# Altium project VISION_BETA_EBB.PrjPcb (part 9 of 9)

## Sheet DAC.SchDoc
size B; SheetNumber: 14; SheetTotal: 19
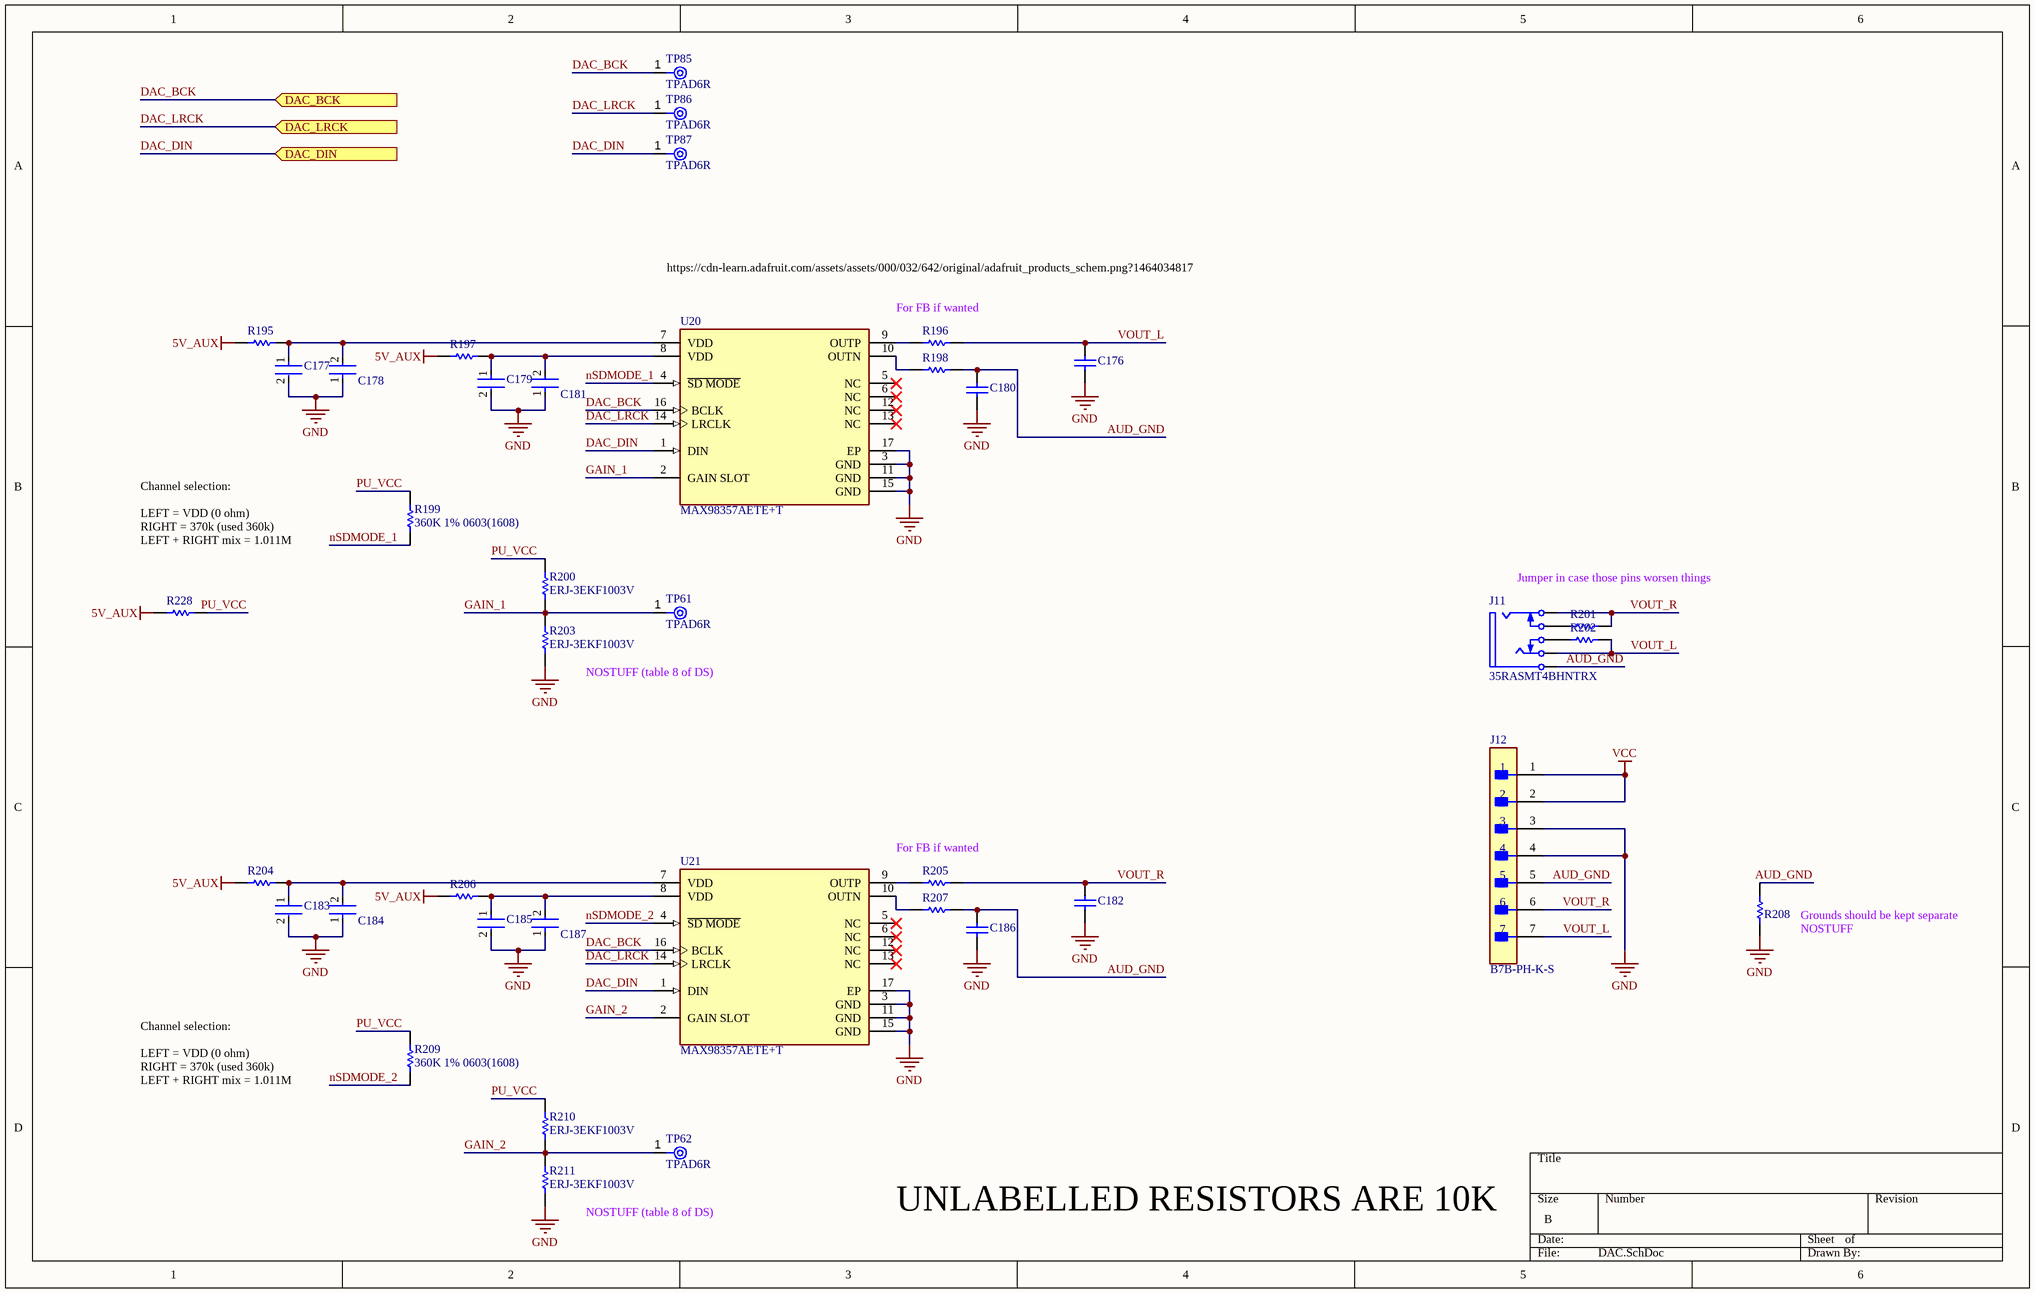
[diagram p45: DAC.SchDoc]

### Parts
C176  C0805C221K5RACTU  [CAPC2013X88X50ML20T25]  (value not drawn)
C177  CL05A106MP5NUNC  [FP-CL05A106MP5NUNC-MFG]  (value not drawn)
C178  C1005X7R1H104K050BB  [FP-C1005-050-0_05-IPC_C]  (value not drawn)
C179  CL05A106MP5NUNC  [FP-CL05A106MP5NUNC-MFG]  (value not drawn)
C180  C0805C221K5RACTU  [CAPC2013X88X50ML20T25]  (value not drawn)
C181  C1005X7R1H104K050BB  [FP-C1005-050-0_05-IPC_C]  (value not drawn)
C182  C0805C221K5RACTU  [CAPC2013X88X50ML20T25]  (value not drawn)
C183  CL05A106MP5NUNC  [FP-CL05A106MP5NUNC-MFG]  (value not drawn)
C184  C1005X7R1H104K050BB  [FP-C1005-050-0_05-IPC_C]  (value not drawn)
C185  CL05A106MP5NUNC  [FP-CL05A106MP5NUNC-MFG]  (value not drawn)
C186  C0805C221K5RACTU  [CAPC2013X88X50ML20T25]  (value not drawn)
C187  C1005X7R1H104K050BB  [FP-C1005-050-0_05-IPC_C]  (value not drawn)
J11  35RASMT4BHNTRX  [SWIT-35RASMT4BHNTRX_V]
J12  B7B-PH-K-S  [FP-B7B-PH-K-S-MFG]
R195  RC0402JR-070RL  [RESC1005X40X25NL05T10]  (value not drawn)
R196  RC0603JR-070RL  [RESC1608X55X25ML10T15]  (value not drawn)
R197  RC0402JR-070RL  [RESC1005X40X25NL05T10]  (value not drawn)
R198  RC0603JR-070RL  [RESC1608X55X25ML10T15]  (value not drawn)
R199  360K 1% 0603(1608)  [RESC0603(1608)_M]
R200  ERJ-3EKF1003V  [RESC1608X55X30ML15T15]
R201  RC0402JR-070RL  [RESC1005X40X25NL05T10]  (value not drawn)
R202  RC0402JR-070RL  [RESC1005X40X25NL05T10]  (value not drawn)
R203  ERJ-3EKF1003V  [RESC1608X55X30ML15T15]
R204  RC0402JR-070RL  [RESC1005X40X25NL05T10]  (value not drawn)
R205  RC0603JR-070RL  [RESC1608X55X25ML10T15]  (value not drawn)
R206  RC0402JR-070RL  [RESC1005X40X25NL05T10]  (value not drawn)
R207  RC0603JR-070RL  [RESC1608X55X25ML10T15]  (value not drawn)
R208  RC0603JR-070RL  [RESC1608X55X25ML10T15]  (value not drawn)
R209  360K 1% 0603(1608)  [RESC0603(1608)_M]
R210  ERJ-3EKF1003V  [RESC1608X55X30ML15T15]
R211  ERJ-3EKF1003V  [RESC1608X55X30ML15T15]
R228  RC0402JR-070RL  [RESC1005X40X25NL05T10]  (value not drawn)
TP61  TPAD6R  [New footprint 1]
TP62  TPAD6R  [New footprint 1]
TP85  TPAD6R  [New footprint 1]
TP86  TPAD6R  [New footprint 1]
TP87  TPAD6R  [New footprint 1]
U20  MAX98357AETE+T  [FP-T1633-4-MFG]
U21  MAX98357AETE+T  [FP-T1633-4-MFG]

### Ports
DAC_BCK (in, see VISION_BETA_EBB[4C]), DAC_DIN (in, see VISION_BETA_EBB[4C]), DAC_LRCK (in, see VISION_BETA_EBB[4C])

### Nets
5V_AUX: R195.1 R197.1 R204.1 R206.1 R228.1  [project net 5V_REG_FB]
GND: C176.1 C177.2 C178.1 C179.2 C180.1 C181.1 C182.1 C183.2 C184.1 C185.2 C186.1 C187.1 J12.3 J12.4 R203.1 R208.2 R211.1 U20.3(GND) U20.11(GND) U20.15(GND) U20.17(EP) U21.3(GND) U21.11(GND) U21.15(GND) U21.17(EP)
VCC: J12.1 J12.2
AUD_GND: C180.2 C186.2 J11.1 J12.5 R198.2 R207.2 R208.1
DAC_BCK: TP85.1(TP) U20.16(BCLK) U21.16(BCLK) ; port DAC_BCK
DAC_DIN: TP87.1(TP) U20.1(DIN) U21.1(DIN) ; port DAC_DIN
DAC_LRCK: TP86.1(TP) U20.14(LRCLK) U21.14(LRCLK) ; port DAC_LRCK
GAIN_1: R200.1 R203.2 TP61.1(TP) U20.2(GAIN_SLOT)
GAIN_2: R210.1 R211.2 TP62.1(TP) U21.2(GAIN_SLOT)
nSDMODE_1: R199.1 U20.4(~{SD_MODE})
nSDMODE_2: R209.1 U21.4(~{SD_MODE})
PU_VCC: R199.2 R200.2 R209.2 R210.2 R228.2
VOUT_L: C176.2 J11.3 J12.7 R196.2 R202.2
VOUT_R: C182.2 J11.2 J12.6 R201.2 R205.2
NetC177_1: C177.1 C178.2 R195.2 U20.7(VDD)
NetC179_1: C179.1 C181.2 R197.2 U20.8(VDD)
NetC183_1: C183.1 C184.2 R204.2 U21.7(VDD)
NetC185_1: C185.1 C187.2 R206.2 U21.8(VDD)
NetJ11_4: J11.4 R201.1
NetJ11_5: J11.5 R202.1
NetR196_1: R196.1 U20.9(OUTP)
NetR198_1: R198.1 U20.10(OUTN)
NetR205_1: R205.1 U21.9(OUTP)
NetR207_1: R207.1 U21.10(OUTN)

Not connected (* = marked no-connect by the designer): U20 5(NC)* 6(NC)* 12(NC)* 13(NC)*; U21 5(NC)* 6(NC)* 12(NC)* 13(NC)*

### Notes on the sheet
- https://cdn-learn.adafruit.com/assets/assets/000/032/642/original/adafruit_products_schem.png?1464034817
- For FB if wanted
- Channel selection:
  LEFT = VDD (0 ohm)
  RIGHT = 370k (used 360k)
  LEFT + RIGHT mix = 1.011M
- Jumper in case those pins worsen things
- NOSTUFF (table 8 of DS)
- (near R208) Grounds should be kept separate
- (near R208) NOSTUFF
- UNLABELLED RESISTORS ARE 10K

### Library data of the parts
C176 C180 C182 C186 = CMP-2007-00321-1: Manufacturer: Kemet; Part Number: C0805C221K5RACTU
C177 C179 C183 C185 = CMP-13271-000002-1: CAP CER 10UF 10V X5R 0402; Manufacturer: Samsung; Temperature Coefficient: 15%; Tolerance: 20%; Material: Ceramic; Octopart: https://octopart.com/cl05a106mp5nunc-samsung-22457395; Voltage Rating: 10V; RoHS: TRUE; Value: 10uF; Height: 0.7mm; Digikey Description: CAP CER 10UF 10V X5R 0402; Automotive: No; Package: CL05A106MP5NUNC; Device Class L1: Passive Components; Capacitance: 10uF; Temperature Range High: +85°C; ComponentLink2Description: Datasheet; Device Class L2: Capacitors; Temperature Characteristic: X5R; Manufacturer Part Number: CL05A106MP5NUNC; Temperature: -55°C to +85°C; ComponentLink2URL: http://www.samsungsem.com/kr/support/product-search/mlcc/__icsFiles/afieldfile/2019/05/10/19-CL05A106MP5NUNC.pdf; Device Class L3: Ceramic Capacitors; Category: Cap; Temperature Range Low: -55°C; Ipc Land Pattern Name: CAPC10050X50; Lead Free: Yes
C178 C181 C184 C187 = CMP-2000-05393-2: Multilayer Ceramic Capacitors 100nF ±10% 50V X7R SMD 0402; Voltage: 50V; Dielectric Material: Ceramic; Min Operating Temperature: -55°C; Depth: 0.5mm; Radiation Hardening: No; RoHS Compliant: Yes; Voltage Rating (DC): 50V; Lead Free: Lead Free; Resistor Type: Ceramic; Height: 0.5mm; Dielectric: X7R; Thickness: 0.022inch; Case/Package: 0402; Case Code (Metric): 1005; Termination: SMD/SMT; Capacitance: 100nF; Packaging: Tape and Reel; Max Operating Temperature: 125°C; Mount: Surface Mount; Package Quantity: 1; Width: 0.02inch; Weight: 2.3E-05oz; Voltage Rating: 50V; Tolerance: 10%; Construction: Flat; Case Code (Imperial): 0402; Length: 1mm; REACH SVHC: No SVHC; Series: C
J11 = CMP-1772-00001-1: Female 3.5 mm Phone Jack, 5 Position, Height 5 mm, RoHS, Tape and Reel; Current Rating: 50 mA; Voltage Rating (DC): 12 V; ComponentLink1URL: http://www.switchcraft.com/; ComponentLink2Description: Datasheet; ComponentLink2URL: http://www.switchcraft.com/Drawings/35rasmt4bhntrx_cd.pdf; PackageDescription: Female 3.5 mm Phone Jack, 5 Position, Height 5 mm; PackageReference: 35RASMT4BHNTRX; Mount: Through Hole; DatasheetVersion: Rev. C, 07/2014; Contact Material: Silver; ComponentLink1Description: Manufacturer URL; Packaging: Tape and Reel; RoHSCompliant: true; Contact Plating: Silver; Package Quantity: 3000
J12 = CMP-17439-000359-1: CONN HEADER VERT 7POS 2MM; Contact Resistance: 10mR; Current Rating: 2A; Pitch: 0.079inch; Test Voltage: 800V; Gender: Male; Insulation Resistance: 1GR; Connector Type: Male Pin; Number of Contacts: 7; Contact Mating Length: 0.13inch; Color: Natural; Contact Material: Bronze; Contact Plating: Tin; Series: PH; Housing Color: Natural; Fastening Type: Detent; Orientation: Vertical; Mount: Through Hole; Housing Material: Nylon; Contact Type: Male Pin; Packaging: Bulk; Lead Free: Contains Lead; Number of Rows: 1; Package Quantity: 500; Termination: Press-Fit; Number of Positions: 7
R195 R197 R201 R202 R204 R206 R228 = CMP-1011-00001-2: Manufacturer: Yageo / Phycomp; Part Number: RC0402JR-070RL
R196 R198 R205 R207 R208 = CMP-2100-03667-1: Chip Resistor, 0 Ohm, +/- 5%, 0.1 W, -55 to 155 degC, 0603 (1608 Metric), RoHS, Tape and Reel; Manufacturer: Yageo; Temperature Coefficient: 200ppm/degreesC; Voltage Rating: 50V; Power Rating: 100mW; Resistance: 0mOhm; Width: 0.8mm; Max Operating Temperature: 155degC; Tolerance: 5%; Package Reference: 0603; Height: 0.45mm; Depth: 0.8mm; Package Description: 2-Pin Surface Mount Device, Body 1.6 x 0.8 mm; Termination: SMD/SMT; Package Quantity: 5000; Case/Package: 0603; Case Code (Imperial): 0603; Radiation Hardening: No; Number of Pins: 2; Length: 1.6mm; Lead Free: LeadFree; Voltage Rating (DC): 50V; Military Standard: Not; Datasheet URL: http://www.yageo.com/NewPortal/yageodocoutput?fileName=/pdf/R-Chip/PYu-RC_Group_51_RoHS_L_5.pdf; Manufacturer URL: http://www.yageo.com/; Packaging: TapeandReel; Case Code (Metric): 1608; Min Operating Temperature: -55degC; Composition: ThickFilm; RoHSCompliant: true; Contact Plating: Tin; Datasheet Version: Rev. 5, 10/2016; REACH SVHC: NoSVHC
R199 R209 = CMP-1012-00798-1: 360K 0.1W 1% 0603 (1608 Metric)  SMD; Case-Metric: 1608; Case-EIA: 0603; Value: 360000.00 Ohm; Power: 0.1 W; Tolerance: 1 %; Technology: SMT
R200 R203 R210 R211 = CMP-2000-00182-1: Manufacturer: Panasonic; Part Number: ERJ-3EKF1003V
TP61 TP62 TP85-TP87 = CMP-00025-2: Test Point .6mm
U20 U21 = CMP-05698-000018-1: IC AMP CLASS D MONO 3.2W 16TQFN; Max Supply Voltage: 5.5V; Max Output Current: 1.6A; Voltage Gain: 15dB; Max Power Dissipation: 1.666W; Min Supply Voltage: 2.5V; Power Supply Rejection Ratio (PSRR): 77dB; Series: -; Contact Plating: Tin; Min Operating Temperature: -40°C; Packaging: Tape and Reel; Max Output Power: 3.2W; Mount: Surface Mount; Number of Pins: 16; RoHS Compliant: Yes; Max Operating Temperature: 85°C; Radiation Hardening: No

## Sheet STM32H730_PINOUT.SchDoc
size D; SheetNumber: 17; SheetTotal: 19
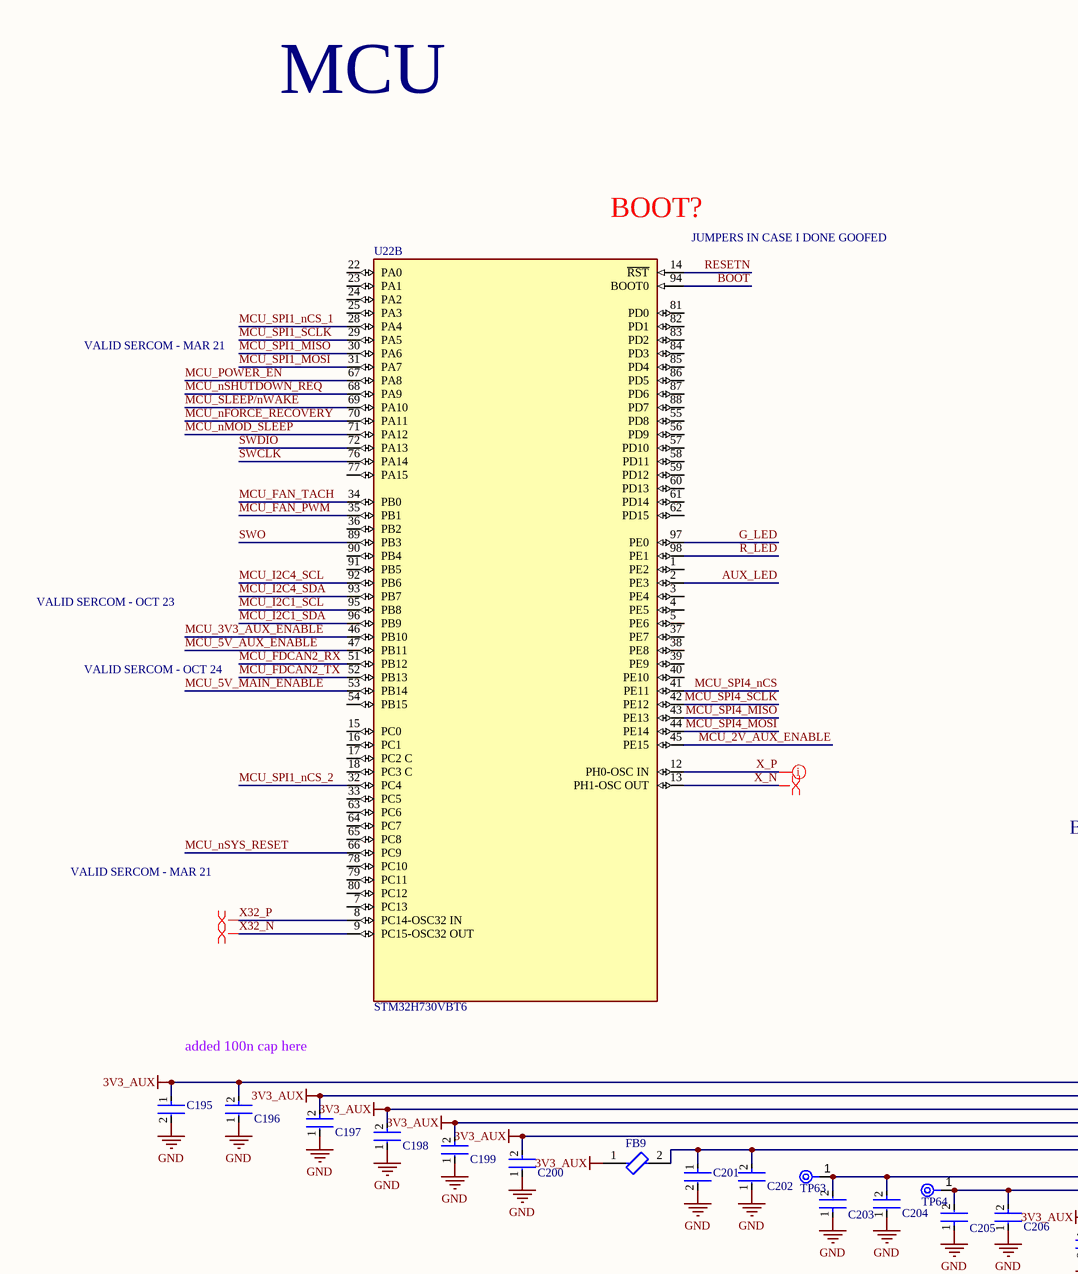
[diagram p46: STM32H730_PINOUT.SchDoc, top left]
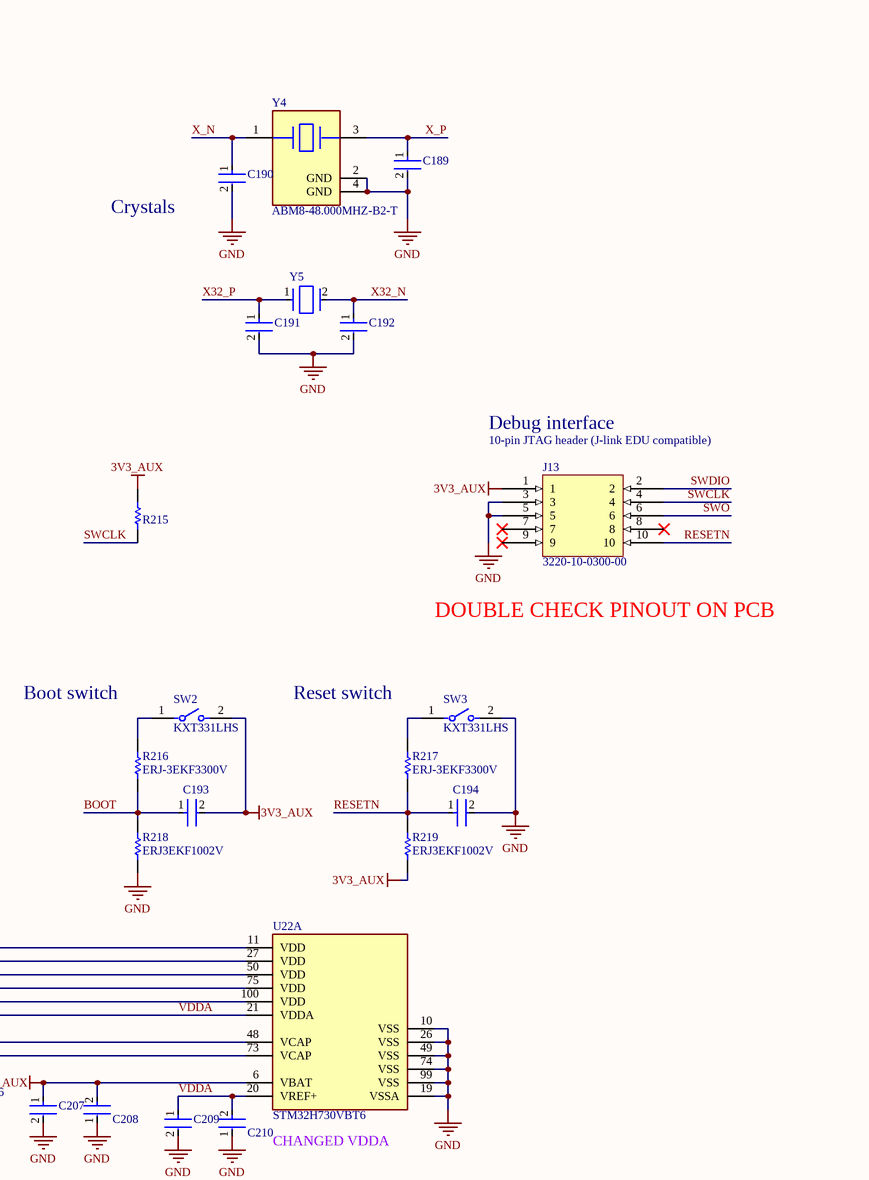
[diagram p47: STM32H730_PINOUT.SchDoc, top middle]
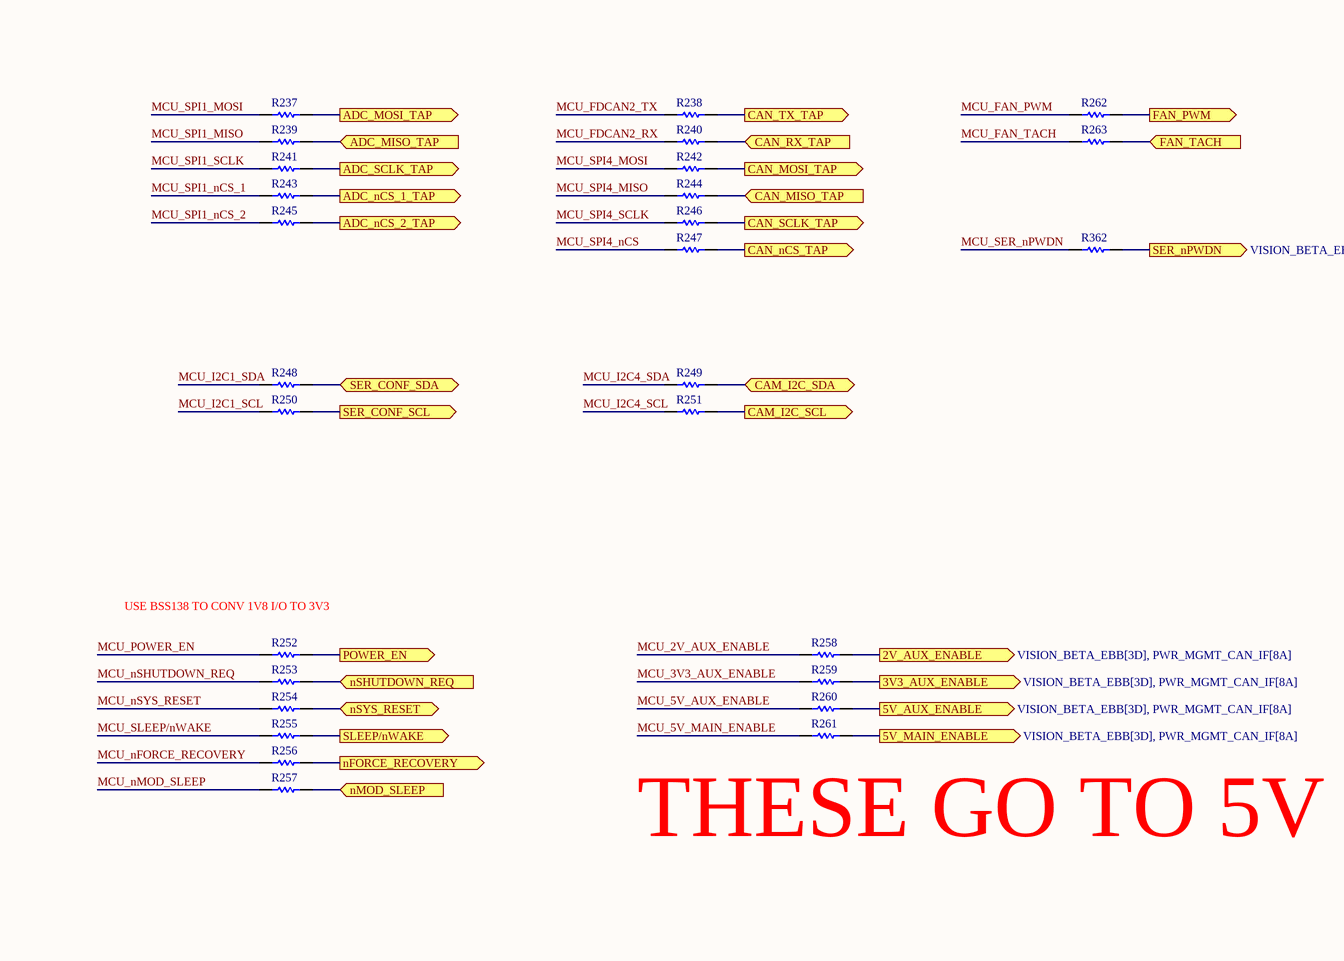
[diagram p48: STM32H730_PINOUT.SchDoc, top right]
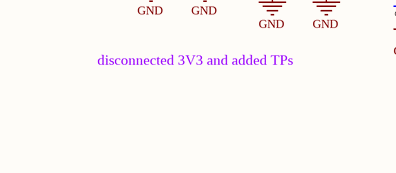
[diagram p49: STM32H730_PINOUT.SchDoc, bottom left]
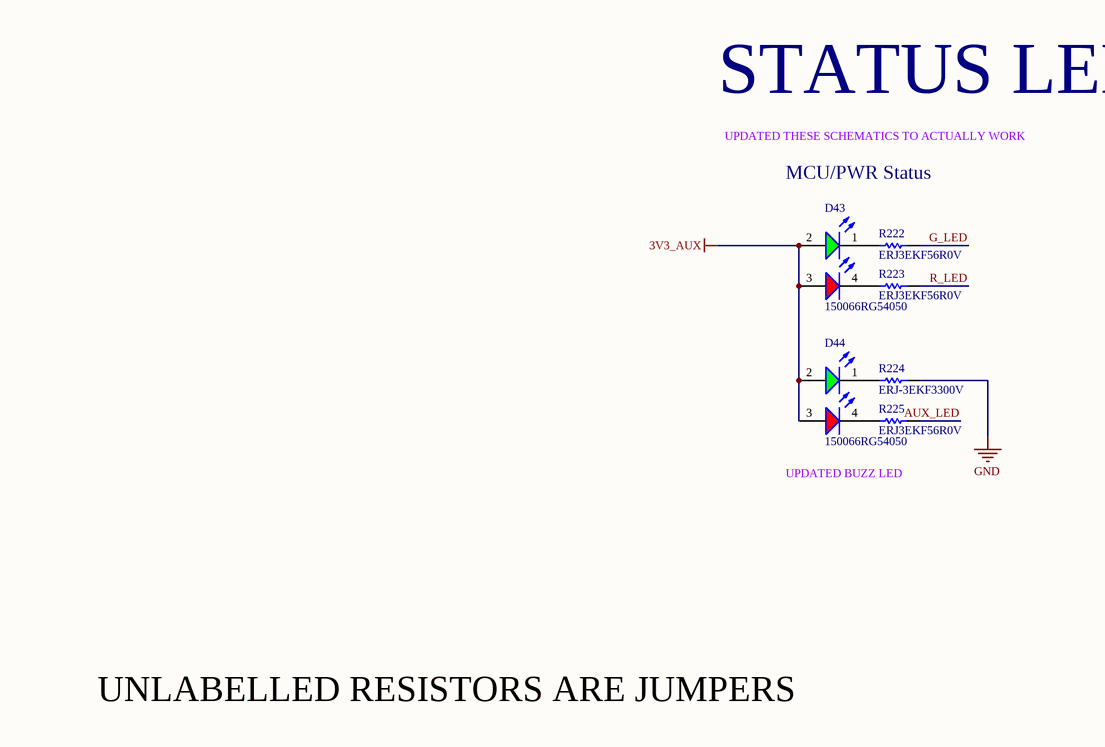
[diagram p50: STM32H730_PINOUT.SchDoc, bottom right]

### Parts
C189  C0402C689C5GACTU  [FP-C0402-BB-MFG]  (value not drawn)
C190  C0402C689C5GACTU  [FP-C0402-BB-MFG]  (value not drawn)
C191  04025A180FAT2A  [FP-0402-L_1_0_1-W_0_5_0_1-IPC_A]  (value not drawn)
C192  04025A180FAT2A  [FP-0402-L_1_0_1-W_0_5_0_1-IPC_A]  (value not drawn)
C193  C0402C104K8PACTU  [FP-C0402-BB-MFG]  (value not drawn)
C194  C0402C104K8PACTU  [FP-C0402-BB-MFG]  (value not drawn)
C195  C1005X5R1A475K050BC  [FP-C1005-050-0_15-MFG]  (value not drawn)
C196  GRM155R71C104KA88D  [FP-GRM15-MFG]  (value not drawn)
C197  GRM155R71C104KA88D  [FP-GRM15-MFG]  (value not drawn)
C198  GRM155R71C104KA88D  [FP-GRM15-MFG]  (value not drawn)
C199  GRM155R71C104KA88D  [FP-GRM15-MFG]  (value not drawn)
C200  GRM155R71C104KA88D  [FP-GRM15-MFG]  (value not drawn)
C201  EMK105BJ105KV-F  [FP-0402-L_1_0_0_05-W_0_5-IPC_A]  (value not drawn)
C202  GRM155R71C104KA88D  [FP-GRM15-MFG]  (value not drawn)
C203  C1005X7S1A225K050BC  [FP-C1005-050-0_15-0_1-MFG]  (value not drawn)
C204  GRM155R71C104KA88D  [FP-GRM15-MFG]  (value not drawn)
C205  C1005X7S1A225K050BC  [FP-C1005-050-0_15-0_1-MFG]  (value not drawn)
C206  GRM155R71C104KA88D  [FP-GRM15-MFG]  (value not drawn)
C207  EMK105BJ105KV-F  [FP-0402-L_1_0_0_05-W_0_5-IPC_A]  (value not drawn)
C208  GRM155R71C104KA88D  [FP-GRM15-MFG]  (value not drawn)
C209  EMK105BJ105KV-F  [FP-0402-L_1_0_0_05-W_0_5-IPC_A]  (value not drawn)
C210  GRM155R71C104KA88D  [FP-GRM15-MFG]  (value not drawn)
D43  150066RG54050  [WL-SBCD_0606]
D44  150066RG54050  [WL-SBCD_0606]
FB9  BLM15PX601SN1D  [FP-BLM15-0_05-MFG]  (value not drawn)
J13  3220-10-0300-00  [3220-10-0300-00-Footprint-1]
R215  ERJ3EKF1002V  [RESC1609X55X30LL15T15]  (value not drawn)
R216  ERJ-3EKF3300V  [RESC1608X55X30LL15T15]
R217  ERJ-3EKF3300V  [RESC1608X55X30LL15T15]
R218  ERJ3EKF1002V  [RESC1609X55X30LL15T15]
R219  ERJ3EKF1002V  [RESC1609X55X30LL15T15]
R222  ERJ3EKF56R0V  [RESC1608X55X30NL15T15]
R223  ERJ3EKF56R0V  [RESC1608X55X30NL15T15]
R224  ERJ-3EKF3300V  [RESC1608X55X30LL15T15]
R225  ERJ3EKF56R0V  [RESC1608X55X30NL15T15]
R237  0402 JUMPER  [RESC1005X40X25ML05T05]  (value not drawn)
R238  0402 JUMPER  [RESC1005X40X25ML05T05]  (value not drawn)
R239  0402 JUMPER  [RESC1005X40X25ML05T05]  (value not drawn)
R240  0402 JUMPER  [RESC1005X40X25ML05T05]  (value not drawn)
R241  0402 JUMPER  [RESC1005X40X25ML05T05]  (value not drawn)
R242  0402 JUMPER  [RESC1005X40X25ML05T05]  (value not drawn)
R243  0402 JUMPER  [RESC1005X40X25ML05T05]  (value not drawn)
R244  0402 JUMPER  [RESC1005X40X25ML05T05]  (value not drawn)
R245  0402 JUMPER  [RESC1005X40X25ML05T05]  (value not drawn)
R246  0402 JUMPER  [RESC1005X40X25ML05T05]  (value not drawn)
R247  0402 JUMPER  [RESC1005X40X25ML05T05]  (value not drawn)
R248  0402 JUMPER  [RESC1005X40X25ML05T05]  (value not drawn)
R249  0402 JUMPER  [RESC1005X40X25ML05T05]  (value not drawn)
R250  0402 JUMPER  [RESC1005X40X25ML05T05]  (value not drawn)
R251  0402 JUMPER  [RESC1005X40X25ML05T05]  (value not drawn)
R252  0402 JUMPER  [RESC1005X40X25ML05T05]  (value not drawn)
R253  0402 JUMPER  [RESC1005X40X25ML05T05]  (value not drawn)
R254  0402 JUMPER  [RESC1005X40X25ML05T05]  (value not drawn)
R255  0402 JUMPER  [RESC1005X40X25ML05T05]  (value not drawn)
R256  0402 JUMPER  [RESC1005X40X25ML05T05]  (value not drawn)
R257  0402 JUMPER  [RESC1005X40X25ML05T05]  (value not drawn)
R258  0402 JUMPER  [RESC1005X40X25ML05T05]  (value not drawn)
R259  0402 JUMPER  [RESC1005X40X25ML05T05]  (value not drawn)
R260  0402 JUMPER  [RESC1005X40X25ML05T05]  (value not drawn)
R261  0402 JUMPER  [RESC1005X40X25ML05T05]  (value not drawn)
R262  0402 JUMPER  [RESC1005X40X25ML05T05]  (value not drawn)
R263  0402 JUMPER  [RESC1005X40X25ML05T05]  (value not drawn)
R362  0402 JUMPER  [RESC1005X40X25ML05T05]  (value not drawn)
SW2  KXT331LHS  [FP-KXT331LHS-MFG]
SW3  KXT331LHS  [FP-KXT331LHS-MFG]
TP63  TPAD6R  [New footprint 1]  (value not drawn)
TP64  TPAD6R  [New footprint 1]  (value not drawn)
U22  STM32H730VBT6  [FP-LQFP100-1L-IPC_C]  (parts A,B of 2)
Y4  ABM8-48.000MHZ-B2-T  [FP-ABM8-MFG]
Y5  ECS-.327-12.5-1210-TR  [FP-ECX-1210-MFG]  (value not drawn)

### Ports
2V_AUX_ENABLE (out, see VISION_BETA_EBB[3D], PWR_MGMT_CAN_IF[8A]), 3V3_AUX_ENABLE (out, see VISION_BETA_EBB[3D], PWR_MGMT_CAN_IF[8A]), 5V_AUX_ENABLE (out, see VISION_BETA_EBB[3D], PWR_MGMT_CAN_IF[8A]), 5V_MAIN_ENABLE (out, see VISION_BETA_EBB[3D], PWR_MGMT_CAN_IF[8A]), ADC_MISO_TAP (in, see VISION_BETA_EBB[3D]), ADC_MOSI_TAP (out, see VISION_BETA_EBB[3D]), ADC_nCS_1_TAP (out, see VISION_BETA_EBB[3D]), ADC_nCS_2_TAP (out, see VISION_BETA_EBB[3D]), ADC_SCLK_TAP (out, see VISION_BETA_EBB[3D]), CAM_I2C_SCL (out, see VISION_BETA_EBB[3D]), CAM_I2C_SDA (bidir, see VISION_BETA_EBB[3D]), CAN_MISO_TAP (in, see VISION_BETA_EBB[3D], PWR_MGMT_CAN_IF[1C]), CAN_MOSI_TAP (out, see VISION_BETA_EBB[3D], PWR_MGMT_CAN_IF[1C]), CAN_nCS_TAP (out, see VISION_BETA_EBB[3D], PWR_MGMT_CAN_IF[1C]), CAN_RX_TAP (in, see VISION_BETA_EBB[3D]), CAN_SCLK_TAP (out, see VISION_BETA_EBB[3D], PWR_MGMT_CAN_IF[1C]), CAN_TX_TAP (out, see VISION_BETA_EBB[3D]), FAN_PWM (out, see VISION_BETA_EBB[3D], FAN_IF[1A]), FAN_TACH (in, see VISION_BETA_EBB[3D], FAN_IF[1A]), nFORCE_RECOVERY (out, see VISION_BETA_EBB[3D], JETSON[9D], PWR_MGMT_CAN_IF[3A]), nMOD_SLEEP (in, see VISION_BETA_EBB[3D], JETSON[9D], PWR_MGMT_CAN_IF[3A]), nSHUTDOWN_REQ (in, see VISION_BETA_EBB[3D], JETSON[9C], PWR_MGMT_CAN_IF[3A]), nSYS_RESET (bidir, see VISION_BETA_EBB[3D], JETSON[9D], PWR_MGMT_CAN_IF[3A]), POWER_EN (out, see VISION_BETA_EBB[3D], JETSON[9D], PWR_MGMT_CAN_IF[3A]), SER_CONF_SCL (out, see VISION_BETA_EBB[3D]), SER_CONF_SDA (bidir, see VISION_BETA_EBB[3D]), SER_nPWDN (out, see VISION_BETA_EBB[3D]), SLEEP/nWAKE (out, see VISION_BETA_EBB[3D], JETSON[9C], PWR_MGMT_CAN_IF[3A])

### Nets
3V3_AUX: C193.2 C195.1 C196.2 C197.2 C198.2 C199.2 C200.2 C207.1 C208.2 D43.2(A) D43.3(A) D44.2(A) D44.3(A) FB9.1 J13.1 R215.1 R219.1 SW2.2 U22.6(VBAT) U22.11(VDD) U22.27(VDD) U22.50(VDD) U22.75(VDD) U22.100(VDD)  [project net 3V3_AUX_FB]
GND: C189.2 C190.2 C191.2 C192.2 C194.2 C195.2 C196.1 C197.1 C198.1 C199.1 C200.1 C201.2 C202.1 C203.1 C204.1 C205.1 C206.1 C207.2 C208.1 C209.2 C210.1 J13.3 J13.5 R218.1 R224.2 SW3.2 U22.10(VSS) U22.19(VSSA) U22.26(VSS) U22.49(VSS) U22.74(VSS) U22.99(VSS) Y4.2(GND) Y4.4(GND)
2V_AUX_ENABLE: R258.2 ; port 2V_AUX_ENABLE
3V3_AUX_ENABLE: R259.2 ; port 3V3_AUX_ENABLE
5V_AUX_ENABLE: R260.2 ; port 5V_AUX_ENABLE
5V_ENABLE: R261.2 ; port 5V_MAIN_ENABLE
ADC_MISO: R239.2 ; port ADC_MISO_TAP
ADC_MOSI: R237.2 ; port ADC_MOSI_TAP
ADC_nCS_1: R243.2 ; port ADC_nCS_1_TAP
ADC_nCS_2: R245.2 ; port ADC_nCS_2_TAP
ADC_SCLK: R241.2 ; port ADC_SCLK_TAP
AUX_LED: R225.1 U22.2(PE3)
BOOT: C193.1 R216.1 R218.2 U22.94(BOOT0)
CAM_I2C_SCL: R250.2 ; port SER_CONF_SCL
CAM_I2C_SDA: R248.2 ; port SER_CONF_SDA
CAN_MISO_TAP: R244.2 ; port CAN_MISO_TAP
CAN_MOSI_TAP: R242.2 ; port CAN_MOSI_TAP
CAN_nCS_TAP: R247.2 ; port CAN_nCS_TAP
CAN_RX: R240.2 ; port CAN_RX_TAP
CAN_SCLK_TAP: R246.2 ; port CAN_SCLK_TAP
CAN_TX: R238.2 ; port CAN_TX_TAP
CONF_SCL: R251.2 ; port CAM_I2C_SCL
CONF_SDA: R249.2 ; port CAM_I2C_SDA
FAN_PWM: R262.2 ; port FAN_PWM
FAN_TACH: R263.2 ; port FAN_TACH
G_LED: R222.1 U22.97(PE0)
HDMI_nSLEEP: R257.2 ; port nMOD_SLEEP
MCU_2V_AUX_ENABLE: R258.1 U22.45(PE15)
MCU_3V3_AUX_ENABLE: R259.1 U22.46(PB10)
MCU_5V_AUX_ENABLE: R260.1 U22.47(PB11)
MCU_5V_MAIN_ENABLE: R261.1 U22.53(PB14)
MCU_FAN_PWM: R262.1 U22.35(PB1)
MCU_FAN_TACH: R263.1 U22.34(PB0)
MCU_FDCAN2_RX: R240.1 U22.51(PB12)
MCU_FDCAN2_TX: R238.1 U22.52(PB13)
MCU_I2C1_SCL: R250.1 U22.95(PB8)
MCU_I2C1_SDA: R248.1 U22.96(PB9)
MCU_I2C4_SCL: R251.1 U22.92(PB6)
MCU_I2C4_SDA: R249.1 U22.93(PB7)
MCU_nFORCE_RECOVERY: R256.1 U22.70(PA11)
MCU_nMOD_SLEEP: R257.1 U22.71(PA12)
MCU_nSHUTDOWN_REQ: R253.1 U22.68(PA9)
MCU_nSYS_RESET: R254.1 U22.66(PC9)
MCU_POWER_EN: R252.1 U22.67(PA8)
MCU_SER_nPWDN: R362.1
MCU_SLEEP/nWAKE: R255.1 U22.69(PA10)
MCU_SPI1_MISO: R239.1 U22.30(PA6)
MCU_SPI1_MOSI: R237.1 U22.31(PA7)
MCU_SPI1_nCS_1: R243.1 U22.28(PA4)
MCU_SPI1_nCS_2: R245.1 U22.32(PC4)
MCU_SPI1_SCLK: R241.1 U22.29(PA5)
MCU_SPI4_MISO: R244.1 U22.43(PE13)
MCU_SPI4_MOSI: R242.1 U22.44(PE14)
MCU_SPI4_nCS: R247.1 U22.41(PE11)
MCU_SPI4_SCLK: R246.1 U22.42(PE12)
nFORCE_RECOVERY: R256.2 ; port nFORCE_RECOVERY
nPWDN: R362.2 ; port SER_nPWDN
nSHUTDOWN_REQ: R253.2 ; port nSHUTDOWN_REQ
nSYS_RESET: R254.2 ; port nSYS_RESET
POWER_EN: R252.2 ; port POWER_EN
R_LED: R223.1 U22.98(PE1)
RESETN: C194.1 J13.10 R217.1 R219.2 U22.14(~{RST})
SLEEP/nWAKE: R255.2 ; port SLEEP/nWAKE
SWCLK: J13.4 R215.2 U22.76(PA14)
SWDIO: J13.2 U22.72(PA13)
SWO: J13.6 U22.89(PB3)
VDDA: C201.1 C202.2 C209.1 C210.2 FB9.2 U22.20(VREF+) U22.21(VDDA)
X32_N: C192.1 U22.9(PC15-OSC32_OUT) Y5.2(Out/In)
X32_P: C191.1 U22.8(PC14-OSC32_IN) Y5.1(In/Out)
X_N: C190.1 U22.13(PH1-OSC_OUT) Y4.1
X_P: C189.1 U22.12(PH0-OSC_IN) Y4.3
NetC203_2: C203.2 C204.2 TP63.1(TP) U22.48(VCAP)
NetC205_2: C205.2 C206.2 TP64.1(TP) U22.73(VCAP)
NetD43_1: D43.1(K) R222.2
NetD43_4: D43.4(K) R223.2
NetD44_1: D44.1(K) R224.1
NetD44_4: D44.4(K) R225.2
NetR216_2: R216.2 SW2.1
NetR217_2: R217.2 SW3.1

Not connected (* = marked no-connect by the designer): J13 7* 8* 9*; U22 1(PE2) 3(PE4) 4(PE5) 5(PE6) 7(PC13) 15(PC0) 16(PC1) 17(PC2_C) 18(PC3_C) 22(PA0) 23(PA1) 24(PA2) 25(PA3) 33(PC5) 36(PB2) 37(PE7) 38(PE8) 39(PE9) 40(PE10) 54(PB15) 55(PD8) 56(PD9) 57(PD10) 58(PD11) 59(PD12) 60(PD13) 61(PD14) 62(PD15) 63(PC6) 64(PC7) 65(PC8) 77(PA15) 78(PC10) 79(PC11) 80(PC12) 81(PD0) 82(PD1) 83(PD2) 84(PD3) 85(PD4) 86(PD5) 87(PD6) 88(PD7) 90(PB4) 91(PB5)

### Layout directives
differential pair: X32_N, X32_P, X_N, X_P

### Notes on the sheet
- MCU
- (near U22) BOOT?
- (near U22) JUMPERS IN CASE I DONE GOOFED
- VALID SERCOM - MAR 21
- (near C190) Crystals
- Debug interface
- VALID SERCOM - OCT 23
- (near J13) 10-pin JTAG header (J-link EDU compatible)
- (near R252) USE BSS138 TO CONV 1V8 I/O TO 3V3
- VALID SERCOM - OCT 24
- DOUBLE CHECK PINOUT ON PCB
- Boot switch
- Reset switch
- (near R261) THESE GO TO 5V
- added 100n cap here
- disconnected 3V3 and added TPs
- CHANGED VDDA
- STATUS LEDs
- UPDATED THESE SCHEMATICS TO ACTUALLY WORK
- MCU/PWR Status
- UPDATED BUZZ LED
- UNLABELLED RESISTORS ARE JUMPERS

### Library data of the parts
C189 C190 = CMP-1034-00517-3: CAP CER 6.8PF 50V NP0 0402; Manufacturer: Kemet; Material: Ceramic; Temperature Characteristic: C0G; Tolerance: 0.25 pF; Temperature Coefficient: 15%; ComponentLink2URL: https://content.kemet.com/datasheets/KEM_C1002_X7R_SMD.pdf; Octopart: https://octopart.com/c0402c689c5gactu-kemet-9143567; RoHS: TRUE; Temperature: -55°C to +125°C; Device Class L2: Capacitors; ComponentLink2Description: Datasheet; Mouser Description: Cap Ceramic 6.8pF 50V C0G 0.25pF SMD 0402 125°C Paper T/R; Device Class L3: Ceramic Capacitors; Digikey Description: CAP CER 6.8PF 50V NP0 0402; Temperature Range High: +125°C; Package: C0402-BB; Voltage Rating: 50 V; Height: 0.55mm; Ipc Land Pattern Name: CAPC10050X50; Value: 6.8 pF; Device Class L1: Passive Components; Category: Cap; Manufacturer Part Number: C0402C689C5GACTU; Capacitance: 6.8 pF; Lead Free: Yes; Automotive: No; Temperature Range Low: -55°C
C191 C192 = CMP-2008-02590-2: General Purpose Ceramic Capacitor, 0402, 18pF, 1%, C0G, 30ppm/°C, 50V; Depth: 0.5mm; Packaging: Tape and Reel; Number of Pins: 2; Tolerance: 1%; Min Operating Temperature: -55°C; Capacitance: 18pF; Termination: SMD/SMT; Lead Free: Lead Free; Case Code (Metric): 1005; Radiation Hardening: No; Package Quantity: 1; Max Operating Temperature: 125°C; Voltage Rating: 50V; Construction: Flat; Dielectric: C0G; Length: 1mm; REACH SVHC: No SVHC; Case Code (Imperial): 0402; Series: -; RoHS Compliant: Yes; Voltage Rating (DC): 50V; Mount: Surface Mount; Case/Package: 0402; Width: 0.5mm; Thickness: 0.022inch; Contact Plating: Tin
C193 C194 = CMP-2008-02046-2: CAP CER 0.1UF 10V X5R 0402; Manufacturer: Kemet; Material: Ceramic; Capacitance: 0.10 μF; Temperature Coefficient: 15%; Tolerance: 0.1; Value: 0.10 μF; Package: C0402-BB; Temperature: -55°C to +125°C; ComponentLink2Description: Datasheet; Temperature Characteristic: X5R; Device Class L1: Passive Components; Height: 0.55mm; Lead Free: Yes; ComponentLink2URL: https://content.kemet.com/datasheets/KEM_C1002_X7R_SMD.pdf; Device Class L2: Capacitors; Temperature Range Low: -55°C; Temperature Range High: +125°C; RoHS: TRUE; Octopart: https://octopart.com/c0402c104k8pactu-kemet-140039; Automotive: No; Mouser Description: Capacitor 100 nF 10 VDC 0402; Category: Cap; Voltage Rating: 10 V; Digikey Description: CAP CER 0.1UF 10V X5R 0402; Ipc Land Pattern Name: CAPC10050X50; Device Class L3: Ceramic Capacitors; Manufacturer Part Number: C0402C104K8PACTU
C195 = CMP-2000-05997-2: CAP CER 4.7UF 10V X5R 0402; Dielectric Material: Ceramic; Tolerance: 10%; Series: C; Package Quantity: 10000; Max Operating Temperature: 85°C; Case Code (Imperial): 0402; Lead Free: Lead Free; Voltage Rating (DC): 10V; Packaging: Cut Tape; Voltage Rating: 10V; Min Operating Temperature: -55°C; Dielectric: X5R; Thickness: 0.022inch; Width: 0.02inch; Case/Package: 0402; Case Code (Metric): 1005; Capacitance: 4.7uF; Length: 0.039inch; RoHS Compliant: Yes; REACH SVHC: No SVHC; Mount: Surface Mount
C196-C200 C202 C204 C206 C208 C210 = CMP-2100-03641-2: CAP CER 0.1UF 16V X7R 0402; Manufacturer: Murata; Standoff Height: 0mm; Tolerance: 10%; Voltage Rating: 16Vdc; Material: Ceramic; Capacitance: 0.10μF; Value: 0.10μF; RoHS: TRUE; Manufacturer Part Number: GRM155R71C104KA88D; Temperature Characteristic: X7R; Octopart: https://octopart.com/grm155r71c104ka88d-murata-196880; Digikey Description: CAP CER 0.1UF 16V X7R 0402; Device Class L3: Ceramic Capacitors; Height: 0.55mm; ComponentLink2Description: Datasheet; Temperature Range Low: -55°C; Ipc Land Pattern Name: CAPC10050X219; ComponentLink2URL: https://search.murata.co.jp/Ceramy/image/img/A01X/G101/ENG/GRM155R71H471KA01-01A.pdf; Device Class L1: Passive Components; Lead Free: yes; Category: Cap; Package: GRM15; Temperature: -55°C to +125°C; Device Class L2: Capacitors; Temperature Range High: +125°C; Mouser Description: 0402 0.1 uF 16V ±10 % Tolerance X7R SMT Multilayer Ceramic Capacitor
C201 C207 C209 = CMP-14477-000104-2: None; Tolerance: 10%; Voltage Rating: 16V; Dielectric: X5R; Capacitance: 1uF; Packaging: Tape and Reel; Depth: 0.5mm; Mount: Surface Mount; Thickness: 0.022inch; Package Quantity: 1; Min Operating Temperature: -55°C; Series: M; Voltage Rating (DC): 16V; Termination: SMD/SMT; Case/Package: 0402; Number of Pins: 2; Case Code (Imperial): 0402; Length: 1mm; Halogen Free: Halogen Free; Case Code (Metric): 1005; Width: 0.02inch; RoHS Compliant: Yes; Radiation Hardening: No; Max Operating Temperature: 85°C; Height: 0.5mm; Construction: Flat
C203 C205 = CMP-08246-004344-1: CAP CER 2.2UF 10V X7S 0402; Dielectric Material: Ceramic; Tolerance: 10%; Mount: Surface Mount; Height: 0.5mm; Package Quantity: 1; Depth: 0.5mm; RoHS Compliant: Yes; Length: 1mm; Thickness: 0.022inch; Packaging: Tape and Reel; Capacitance: 2.2uF; Case Code (Imperial): 0402; Resistor Type: Ceramic; Dielectric: X7S; Case/Package: 0402; Min Operating Temperature: -55°C; Voltage Rating: 10V; Series: C; Weight: 2.3E-05oz; Width: 0.02inch; Voltage Rating (DC): 10V; Case Code (Metric): 1005; Max Operating Temperature: 125°C; Termination: SMD/SMT; Lead Free: Lead Free
D43 D44 = CMP-004-00040-2: Led, Red/Grn, 180Mcd/230Mcd, 624Nm/525Nm Rohs Compliant: Yes; Source: rgled.SchLib; Component Type: Standard; Design Item ID: CMP-004-00034-2; Pins: 4
FB9 = CMP-0686-00252-4: Chip Ferrite Bead, 0402, 600Ω @ 100MHz, 0.23Ω, 25%, 900mA; Number of Circuits: 1; Impedance: 600R; DC Resistance (DCR): 230mR; Material: Steel; Length: 1mm; Package Quantity: 10000; Height: 0.5mm; Width: 0.5mm; Max DC Current: 900mA; Number of Lines: 1; Termination: SMD/SMT; Packaging: Tape and Reel; Lead Free: Lead Free; Min Operating Temperature: -55°C; Max Operating Temperature: 125°C; Max Current Rating: 900mA; Case Code (Imperial): 0402; Number of Pins: 2; Current Rating: 900mA; Test Frequency: 100MHz; Case/Package: 0402; Tolerance: 25%; Case Code (Metric): 1005
J13 = CMP-001-0013-3: CONN HEADER SMD 10POS 1.27MM
R215 R218 R219 = CMP-1012-00623-3: Chip Resistor, 10 KOhm, +/- 1%, 0.1 W, -55 to 155 degC, 0603 (1608 Metric), RoHS, Tape and Reel; Manufacturer: Panasonic; Voltage Rating: 75V; Case\/Package: 0603; Power Rating: 100mW; Resistance: 10KOhm; Temperature Coefficient: 100ppm\/degreesC; Number of Pins: 2; Package Reference: 603; Depth: 0.8mm; Mount: SurfaceMount; Package Description: 2-Pin Surface Mount Device, Body 1.6 x 0.85 mm; Datasheet Version: 02/2017; Length: 1.6mm; Lead Free: LeadFree; Height: 0.45mm; Number of Terminations: 2; Max Power Dissipation: 100mW; Min Operating Temperature: -55degC; Datasheet URL: https://industrial.panasonic.com/cdbs/www-data/pdf/RDA0000/AOA0000C304.pdf; Termination: SMD/SMT; Case Code (Metric): 1608; Case Code (Imperial): 0603; Tolerance: 1%; Max Operating Temperature: 155degC; RoHSCompliant: true; Voltage Rating (DC): 75V; Radiation Hardening: No; Packaging: TapeandReel; Composition: ThickFilm; Mounting Technology: SurfaceMount; Manufacturer URL: http://www.panasonic.com/; Width: 0.031inch; REACH SVHC: NoSVHC; Contact Plating: Tin; Military Standard: Not; Package Quantity: 1
R216 R217 R224 = CMP-2000-00435-2: Chip Resistor, 330 Ohm, +/- 1%, 0.1 W, -55 to 155 degC, 0603 (1608 Metric), RoHS, Tape and Reel; Gender: Male; Mating Cycles: 10000; Current Rating: 500 mA; Voltage Rating: 10 V; REACH SVHC: No SVHC; PackageDescription: 2-Pin Surface Mount Device, Body 1.6 x 0.85 mm; Contact Finish: Gold; Pins: 8; ComponentLink1Description: Manufacturer URL; Packaging: Tape and Reel; Max Operating Temperature: 85 degC; Contact Material: Copper; Height: 1.45 mm; Width: 1.45 mm; DatasheetVersion: Apr-15; Package Quantity: 1500; Contact Plating: Gold; PackageReference: 0603; Mount: Surface Mount; Lead Pitch: 1.1 mm; Min Operating Temperature: -25 degC; ComponentLink1URL: http://www.panasonic.com/; ComponentLink2URL: http://industrial.panasonic.com/cdbs/www-data/pdf/RDA0000/AOA0000C86.pdf; Length: 13.7 mm; ComponentLink2Description: Datasheet; RoHSCompliant: true
R222 R223 R225 = CMP-2000-00572-1: Manufacturer: Panasonic; Part Number: ERJ3EKF56R0V
R237-R263 R362 = CMP-009-00118-2: READ THE NAME; Pins: 2; Component Type: Standard; Design Item ID: CMP-009-00206-2; Source: 0402jump.SchLib
SW2 SW3 = CMP-10040-000029-1: SWITCH TACTILE SPST-NO 0.02A 15V; Operating Force: 240gf; Switch Travel: 0.13mm; Illumination Type: Non-Illuminated; Throw Configuration: SPST; Number of Ports: 1; Current Rating: 5A; Mechanical Life: 500000Cycles; Switch Function: Off-Mom; Connector Type: USB; Actuator Type: Standard; Gender: Receptacle; Number of Contacts: 24; Contact Plating: Gold; Insulation Color: Black; Min Operating Temperature: -40°C; Packaging: Tape and Reel; Flammability Rating: UL94 V-0; Max Operating Temperature: 85°C; Termination: Solder; Mount: Surface Mount
TP63 TP64 = CMP-00025-2: Test Point .6mm
U22 = CMP-12105-000107-1: IC MCU 32BIT 128KB FLASH 100LQFP
Y4 = CMP-27762-011708-1: Crystal 48MHz ±20ppm 18pF SMD-4 3.2mm x 2.5mm; Series Resistance: 35R; Frequency Stability: 50ppm; Package Quantity: 1000; Packaging: Tape and Reel; Mount: Surface Mount; Length: 3.2mm; Load Capacitance: 18pF; Max Operating Temperature: 70°C; Operating Frequency: 48 MHz; RoHS Compliant: Yes; Series: ABM8; Frequency Tolerance: 20ppm; Lead Free: Lead Free; Min Operating Temperature: -20°C; Case/Package: CSMD; Number of Pins: 4; Height: 0.031inch; ESR (Equivalent Series Resistance): 35R; Frequency: 48MHz; Radiation Hardening: No; Width: 0.098inch; Tolerance: 20ppm; Termination: SMD/SMT; Depth: 2.5mm; Resistor Type: Ceramic; REACH SVHC: No SVHC
Y5 = CMP-40224-000006-1: CRYSTAL 32.7680KHZ 12.5PF SMD; Manufacturer: ECS International; Frequency: 32.768kHz; Esr: 90kΩ; Tolerance: 20ppm; Device Class L1: Passive Components; Load Capacitance: 12.5pF; Temperature: -40°C to +85°C; ComponentLink2URL: https://ecsxtal.com/store/pdf/ECX-1210.pdf; Series: ECX-1210; Octopart: https://octopart.com/ecs-.327-12.5-1210-tr-ecs+international-81221340; ComponentLink2Description: Datasheet; Temperature Range Low: -40°C; Digikey Description: CRYSTAL 32.7680KHZ 12.5PF SMD; Lead Free: Yes; RoHS: TRUE; Device Class L3: Crystals; Automotive: No; Category: Crys; Height: 0.5mm; Manufacturer Part Number: ECS-.327-12.5-1210-TR; Temperature Range High: +85°C; Device Class L2: Crystals / Oscillators; Package: ECX-1210

## Sheet RAIL_DISCHARGE.SchDoc
size A4; SheetNumber: 19; SheetTotal: 19
Used 3 times, as channels RAIL_DISCH_0, RAIL_DISCH_1, RAIL_DISCH_2. Parts and nets are listed once, with the designators drawn on the sheet.
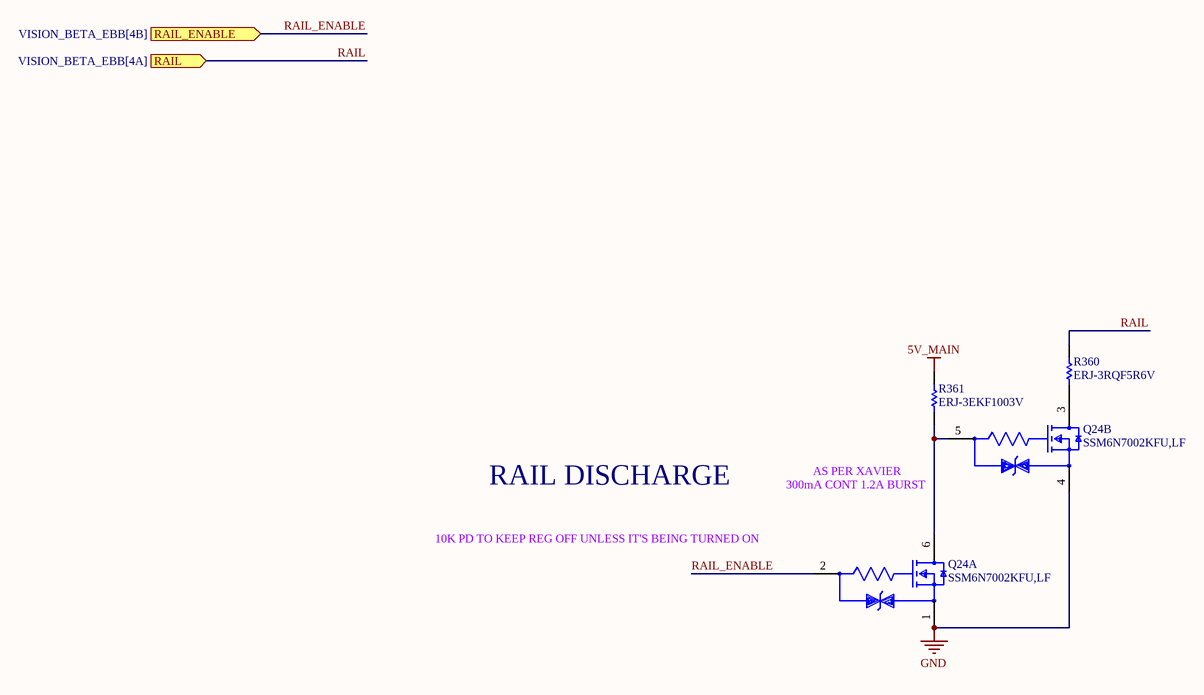
[diagram p51: RAIL_DISCHARGE.SchDoc]

### Parts
Q24  SSM6N7002KFU,LF  [FP-SSOP6-P-0_65A-MFG]  (parts A,B of 2)
R360  ERJ-3RQF5R6V  [RESC1608X55X30LL15T15]
R361  ERJ-3EKF1003V  [RESC1608X55X30ML15T15]

### Ports
RAIL (in, see VISION_BETA_EBB[4A]), RAIL_ENABLE (in, see VISION_BETA_EBB[4B])

### Nets
5V_MAIN: R361.2
GND: Q24.1(Source1) Q24.4(Source2)
RAIL: R360.2 ; port RAIL
RAIL_ENABLE: Q24.2(Gate1) ; port RAIL_ENABLE
NetQ24_3: Q24.3(Drain2) R360.1
NetQ24_5: Q24.5(Gate2) Q24.6(Drain1) R361.1

### Channels
RAIL_DISCH_0: designators end in _RAIL_DISCH_0; ports RAIL=5V_REG_FB RAIL_ENABLE=5V_AUX_ENABLE
RAIL_DISCH_1: designators end in _RAIL_DISCH_1; ports RAIL=3V3_AUX_FB RAIL_ENABLE=3V3_AUX_ENABLE
RAIL_DISCH_2: designators end in _RAIL_DISCH_2; ports RAIL=2V_AUX_OUT RAIL_ENABLE=2V_AUX_ENABLE

### Notes on the sheet
- RAIL DISCHARGE
- 300mA CONT 1.2A BURST
- AS PER XAVIER
- 10K PD TO KEEP REG OFF UNLESS IT'S BEING TURNED ON

### Library data of the parts
Q24 = CMP-35916-000009-1: MOSFET 2N-CH 60V 0.3A; Input Capacitance: 40pF; Continuous Drain Current (ID): 300mA; Max Power Dissipation: 285mW; FET Type: 2 N-Channel; Rds On Max: 1.5R; Mount: Surface Mount; Drain to Source Voltage (Vdss): 60V; Packaging: Tape and Reel
R360 = CMP-2000-00850-1: Manufacturer: Panasonic; Part Number: ERJ-3RQF5R6V
R361 = CMP-2000-00182-1: Manufacturer: Panasonic; Part Number: ERJ-3EKF1003V

## Nets that join several sheets
2V_AUX_OUT: JETSON (C214.2 U24.3), USB (C96.2 TP59.1 U9.3), GMSL_DESERIALIZER_0 (C52_GMSL_DESERIALIZER_0.2 C53_GMSL_DESERIALIZER_0.2 U2_GMSL_DESERIALIZER_0.3 U3_GMSL_DESERIALIZER_0.3), GMSL_DESERIALIZER_1 (C52_GMSL_DESERIALIZER_1.2 C53_GMSL_DESERIALIZER_1.2 U2_GMSL_DESERIALIZER_1.3 U3_GMSL_DESERIALIZER_1.3), 2V_REG (10 pins), GMSL_SERIALIZER (C251.2 C252.2 U29.3 U30.3), RAIL_DISCH_2 (R360_RAIL_DISCH_2.2)
3V3_AUX_FB: JETSON (R174.2), USB (13 pins), ETHERNET (C99.2 C100.2 R60.2 R61.2), HDMI (R91.1 R280.2 U10.4), NVME (21 pins), GMSL_DESERIALIZER_0 (6 pins), GMSL_DESERIALIZER_1 (6 pins), PWR_MGMT (16 pins), REG_0 (R136_REG_0.2), 2V_REG (R132.2), 3V3_REG (10 pins), ADC (7 pins), GMSL_SERIALIZER (8 pins), AUX_FAN_IF (Q17_AUX_FAN_IF.1 R221_AUX_FAN_IF.1 R236_AUX_FAN_IF.1), REG_1 (R136_REG_1.2), STM32H730_PINOUT (24 pins), RAIL_DISCH_1 (R360_RAIL_DISCH_1.2)
5V_REG_FB: VISION_BETA_EBB (R229.1), JETSON (17 pins), REG_0 (10 pins), REG_1 (R?_REG_1#2.2), RAIL_DISCH_0 (R361_RAIL_DISCH_0.2), RAIL_DISCH_1 (R361_RAIL_DISCH_1.2), RAIL_DISCH_2 (R361_RAIL_DISCH_2.2)
5V_REG_FB: USB (12 pins), HDMI (C104.1 C105.2 R283.2 U31.4), SoC_FAN_IF (R214_SoC_FAN_IF.1 R230_SoC_FAN_IF.1 R236_SoC_FAN_IF.1 R297_SoC_FAN_IF.2), DAC (5 pins), AUX_FAN_IF (R214_AUX_FAN_IF.1 R230_AUX_FAN_IF.1 R297_AUX_FAN_IF.2), REG_1 (9 pins), RAIL_DISCH_0 (R360_RAIL_DISCH_0.2)
FAN_VDDIO: JETSON (24 pins), HDMI (R287.1), NVME (R290.2), RECOVERY_USBC (R296.2), SoC_FAN_IF (Q17_SoC_FAN_IF.1 R221_SoC_FAN_IF.1), PWR_MGMT_CAN_IF (R35.2)
GND: VISION_BETA_EBB (7 pins), JETSON (126 pins), USB (66 pins), ETHERNET (12 pins), HDMI (32 pins), NVME (33 pins), GMSL_DESERIALIZER_0 (51 pins), RECOVERY_USBC (8 pins), GMSL_DESERIALIZER_1 (51 pins), PWR_MGMT (35 pins), REG_0 (15 pins), 2V_REG (16 pins), 3V3_REG (13 pins), ADC (12 pins), GMSL_SERIALIZER (31 pins), SoC_FAN_IF (8 pins), PWR_MGMT_CAN_IF (36 pins), DAC (25 pins), AUX_FAN_IF (8 pins), REG_1 (15 pins), STM32H730_PINOUT (34 pins), RAIL_DISCH_0 (Q24_RAIL_DISCH_0.1 Q24_RAIL_DISCH_0.4), RAIL_DISCH_1 (Q24_RAIL_DISCH_1.1 Q24_RAIL_DISCH_1.4), RAIL_DISCH_2 (Q24_RAIL_DISCH_2.1 Q24_RAIL_DISCH_2.4)
INT_VCC: GMSL_DESERIALIZER_0 (5 pins), GMSL_DESERIALIZER_1 (5 pins), PWR_MGMT (R158.1 U18.3 U18.4), GMSL_SERIALIZER (F7.1 TP81.1), SoC_FAN_IF (F6_SoC_FAN_IF.1), AUX_FAN_IF (F6_AUX_FAN_IF.1), REG_1 (5 pins)
1V8_SMB_nALERT: JETSON (R176.1 U12.2), NVME (R291.2)
2V_AUX_ENABLE: 2V_REG (R119.1 TP37.1), PWR_MGMT_CAN_IF (R336.2), STM32H730_PINOUT (R258.2), RAIL_DISCH_2 (Q24_RAIL_DISCH_2.2)
2V_AUX_I_SENSE: PWR_MGMT (C220.2 U27.11), ADC (U16.4)
2V_AUX_TEMP: 2V_REG (R132.1 R133.2 TP90.1), ADC (U16.10)
2V_AUX_V_SENSE: 2V_REG (R114.2 R115.2), ADC (U16.11)
2V_AUX_VCC: PWR_MGMT (U27.3 U27.4), 2V_REG (5 pins)
3V3_AUX_ENABLE: 3V3_REG (R123.1 TP33.1), PWR_MGMT_CAN_IF (R313.2), STM32H730_PINOUT (R259.2), RAIL_DISCH_1 (Q24_RAIL_DISCH_1.2)
3V3_AUX_I_SENSE: PWR_MGMT (C218.2 U26.11), ADC (U16.5)
3V3_AUX_TEMP: 3V3_REG (R134.1 R135.2), ADC (U16.9)
3V3_AUX_V_SENSE: 3V3_REG (R121.2 R183.2), ADC (U17.11)
3V3_AUX_VCC: PWR_MGMT (U26.3 U26.4), 3V3_REG (C148.2 C149.2 TP15.1 U14.2)
5V_AUX_ENABLE: PWR_MGMT_CAN_IF (R305.2), REG_1 (R128_REG_1.1 TP30_REG_1.1), STM32H730_PINOUT (R260.2), RAIL_DISCH_0 (Q24_RAIL_DISCH_0.2)
5V_AUX_TEMP: ADC (U17.10), REG_1 (R136_REG_1.1 R137_REG_1.2)
5V_AUX_V_SENSE: ADC (U17.9), REG_1 (R125_REG_1.1 R126_REG_1.2)
5V_ENABLE: REG_0 (R128_REG_0.1 TP30_REG_0.1), PWR_MGMT_CAN_IF (R335.2), STM32H730_PINOUT (R261.2)
5V_MAIN_I_SENSE: PWR_MGMT (C216.2 U25.11), ADC (U16.6)
5V_MAIN_TEMP: REG_0 (R136_REG_0.1 R137_REG_0.2), ADC (U17.8)
5V_MAIN_V_SENSE: REG_0 (R125_REG_0.1 R126_REG_0.2), ADC (U17.7)
5V_MAIN_VCC: PWR_MGMT (U25.3 U25.4), REG_0 (5 pins)
ADC_MISO: JETSON (R270.2), ADC (U16.15 U17.15), STM32H730_PINOUT (R239.2)
ADC_MOSI: JETSON (R264.2), ADC (U16.14 U17.14), STM32H730_PINOUT (R237.2)
ADC_nCS_1: JETSON (R273.2), ADC (U16.1), STM32H730_PINOUT (R243.2)
ADC_nCS_2: JETSON (R276.2), ADC (U17.1), STM32H730_PINOUT (R245.2)
ADC_SCLK: JETSON (R267.2), ADC (U16.16 U17.16), STM32H730_PINOUT (R241.2)
BATT_PWR: PWR_MGMT (11 pins), PWR_MGMT_CAN_IF (C265.1 C267.1 U41.1 U42.1)
CAM0_PWDN: VISION_BETA_EBB (R295.1), JETSON (Q9.6), GMSL_DESERIALIZER_0 (R12_GMSL_DESERIALIZER_0.2 TP51_GMSL_DESERIALIZER_0.1)
CAM1_PWDN: JETSON (Q9.3), GMSL_DESERIALIZER_1 (R12_GMSL_DESERIALIZER_1.2 TP51_GMSL_DESERIALIZER_1.1)
CAM_I2C_SCL: JETSON (D18.4 D18.7 J1.213), GMSL_DESERIALIZER_0 (R19_GMSL_DESERIALIZER_0.1 TP42_GMSL_DESERIALIZER_0.1 U1_GMSL_DESERIALIZER_0.29), GMSL_DESERIALIZER_1 (R19_GMSL_DESERIALIZER_1.1 TP42_GMSL_DESERIALIZER_1.1 U1_GMSL_DESERIALIZER_1.29), STM32H730_PINOUT (R250.2)
CAM_I2C_SDA: JETSON (D18.5 D18.6 J1.215), GMSL_DESERIALIZER_0 (R15_GMSL_DESERIALIZER_0.1 TP40_GMSL_DESERIALIZER_0.1 U1_GMSL_DESERIALIZER_0.28), GMSL_DESERIALIZER_1 (R15_GMSL_DESERIALIZER_1.1 TP40_GMSL_DESERIALIZER_1.1 U1_GMSL_DESERIALIZER_1.28), STM32H730_PINOUT (R248.2)
CAN_MISO_TAP: PWR_MGMT_CAN_IF (R357.1), STM32H730_PINOUT (R244.2)
CAN_MOSI_TAP: PWR_MGMT_CAN_IF (R356.1), STM32H730_PINOUT (R242.2)
CAN_N: VISION_BETA_EBB (J8.1), PWR_MGMT_CAN_IF (C169.1 D41.1 L12.4 R178.1)
CAN_nCS_TAP: PWR_MGMT_CAN_IF (R359.1), STM32H730_PINOUT (R247.2)
CAN_P: VISION_BETA_EBB (J8.4), PWR_MGMT_CAN_IF (C175.2 D41.2 L12.1 R182.2)
CAN_PWR: VISION_BETA_EBB (J8.5 J8.6), ADC (R212.2), PWR_MGMT_CAN_IF (D42.2)
CAN_RX: JETSON (D17.1 D17.10 J1.143), PWR_MGMT_CAN_IF (TP25.1 U19.4), STM32H730_PINOUT (R240.2)
CAN_SCLK_TAP: PWR_MGMT_CAN_IF (R358.1), STM32H730_PINOUT (R246.2)
CAN_TX: JETSON (D17.2 D17.9 J1.145), PWR_MGMT_CAN_IF (TP23.1 U19.1), STM32H730_PINOUT (R238.2)
CONF_SCL: GMSL_SERIALIZER (R167.1 U28.6), STM32H730_PINOUT (R251.2)
CONF_SDA: GMSL_SERIALIZER (R166.1 U28.5), STM32H730_PINOUT (R249.2)
CSI0_CLK_N: JETSON (D6.2 D6.9 J1.10), GMSL_DESERIALIZER_0 (C14_GMSL_DESERIALIZER_0.1)
CSI0_CLK_P: JETSON (D6.1 D6.10 J1.12), GMSL_DESERIALIZER_0 (C11_GMSL_DESERIALIZER_0.1)
CSI0_D0_N: JETSON (D6.5 D6.6 J1.4), GMSL_DESERIALIZER_0 (C2_GMSL_DESERIALIZER_0.1)
CSI0_D0_P: JETSON (D6.4 D6.7 J1.6), GMSL_DESERIALIZER_0 (C1_GMSL_DESERIALIZER_0.1)
CSI0_D1_N: JETSON (R3.2), GMSL_DESERIALIZER_0 (C4_GMSL_DESERIALIZER_0.1)
CSI0_D1_P: JETSON (R4.2), GMSL_DESERIALIZER_0 (C3_GMSL_DESERIALIZER_0.1)
CSI1_D0_N: JETSON (R5.2), GMSL_DESERIALIZER_0 (C6_GMSL_DESERIALIZER_0.1)
CSI1_D0_P: JETSON (R6.2), GMSL_DESERIALIZER_0 (C5_GMSL_DESERIALIZER_0.1)
CSI1_D1_N: JETSON (D7.4 D7.7 J1.15), GMSL_DESERIALIZER_0 (C10_GMSL_DESERIALIZER_0.1)
CSI1_D1_P: JETSON (D7.5 D7.6 J1.17), GMSL_DESERIALIZER_0 (C9_GMSL_DESERIALIZER_0.1)
CSI2_CLK_N: JETSON (D19.1 D19.10 J1.28), GMSL_DESERIALIZER_1 (C14_GMSL_DESERIALIZER_1.1)
CSI2_CLK_P: JETSON (D19.2 D19.9 J1.30), GMSL_DESERIALIZER_1 (C11_GMSL_DESERIALIZER_1.1)
CSI2_D0_N: JETSON (D13.4 D13.7 J1.22), GMSL_DESERIALIZER_1 (C2_GMSL_DESERIALIZER_1.1)
CSI2_D0_P: JETSON (D13.5 D13.6 J1.24), GMSL_DESERIALIZER_1 (C1_GMSL_DESERIALIZER_1.1)
CSI2_D1_N: JETSON (D19.4 D19.7 J1.34), GMSL_DESERIALIZER_1 (C4_GMSL_DESERIALIZER_1.1)
CSI2_D1_P: JETSON (D19.5 D19.6 J1.36), GMSL_DESERIALIZER_1 (C3_GMSL_DESERIALIZER_1.1)
CSI3_D0_N: JETSON (D14.1 D14.10 J1.21), GMSL_DESERIALIZER_1 (C6_GMSL_DESERIALIZER_1.1)
CSI3_D0_P: JETSON (D14.2 D14.9 J1.23), GMSL_DESERIALIZER_1 (C5_GMSL_DESERIALIZER_1.1)
CSI3_D1_N: JETSON (D14.4 D14.7 J1.33), GMSL_DESERIALIZER_1 (C10_GMSL_DESERIALIZER_1.1)
CSI3_D1_P: JETSON (D14.5 D14.6 J1.35), GMSL_DESERIALIZER_1 (C9_GMSL_DESERIALIZER_1.1)
DAC_BCK: JETSON (D4.5 D4.6 J1.199 TP89.1), DAC (TP85.1 U20.16 U21.16)
DAC_DIN: JETSON (D4.1 D4.10 J1.193 TP21.1), DAC (TP87.1 U20.1 U21.1)
DAC_LRCK: JETSON (D4.4 D4.7 J1.197 TP88.1), DAC (TP86.1 U20.14 U21.14)
DEBUG_RXD: VISION_BETA_EBB (J16.4), JETSON (R64.2)
DEBUG_TXD: VISION_BETA_EBB (J16.3), JETSON (R122.2)
DP1_AUX_N: JETSON (D20.4 D20.7 J1.98), HDMI (Q3.2 R80.1)
DP1_AUX_P: JETSON (D20.5 D20.6 J1.100), HDMI (Q4.2 R88.1)
DP1_HPD: JETSON (D20.2 D20.9 J1.96), HDMI (Q2.3 R75.1)
DP1_TXD0_N: JETSON (D8.1 D8.10 J1.63), HDMI (C107.1)
DP1_TXD0_P: JETSON (D8.2 D8.9 J1.65), HDMI (C106.1)
DP1_TXD1_N: JETSON (D8.4 D8.7 J1.69), HDMI (C109.1)
DP1_TXD1_P: JETSON (D8.5 D8.6 J1.71), HDMI (C108.1)
DP1_TXD2_N: JETSON (D15.1 D15.10 J1.75), HDMI (C111.1)
DP1_TXD2_P: JETSON (D15.2 D15.9 J1.77), HDMI (C110.1)
DP1_TXD3_N: JETSON (D15.4 D15.7 J1.81), HDMI (C113.1)
DP1_TXD3_P: JETSON (D15.5 D15.6 J1.83), HDMI (C112.1)
DP_HDMI_CEC: JETSON (D20.1 D20.10 J1.94), HDMI (D35.1 Q6.2 R94.1)
ENABLE: PWR_MGMT (R141.1 R144.1), PWR_MGMT_CAN_IF (R363.2)
FAN_PWM: JETSON (J1.230), SoC_FAN_IF (R231_SoC_FAN_IF.1)
FAN_PWM: AUX_FAN_IF (R231_AUX_FAN_IF.1), STM32H730_PINOUT (R262.2)
FAN_TACH: JETSON (J1.208), SoC_FAN_IF (R220_SoC_FAN_IF.1)
FAN_TACH: AUX_FAN_IF (R220_AUX_FAN_IF.1), STM32H730_PINOUT (R263.2)
FLIP0_N: JETSON (D21.1 D21.10 J1.134), NVME (C119.2)
FLIP0_P: JETSON (D21.2 D21.9 J1.136), NVME (C120.2)
FLIP1_N: JETSON (D21.4 D21.7 J1.140), NVME (C121.2)
FLIP1_P: JETSON (D21.5 D21.6 J1.142), NVME (C122.2)
FLIP2_N: JETSON (D11.1 D11.10 J1.148), NVME (C123.2)
FLIP2_P: JETSON (D11.2 D11.9 J1.150), NVME (C124.2)
FLIP3_N: JETSON (D11.4 D11.7 J1.154), NVME (C128.2)
FLIP3_P: JETSON (D11.5 D11.6 J1.156), NVME (C135.2)
FLIP4_N: JETSON (D10.1 D10.10 J1.131), NVME (R97.2)
FLIP4_P: JETSON (D10.2 D10.9 J1.133), NVME (R98.2)
FLIP5_N: JETSON (D10.4 D10.7 J1.137), NVME (R99.2)
FLIP5_P: JETSON (D10.5 D10.6 J1.139), NVME (R100.2)
FLIP6_N: JETSON (D17.4 D17.7 J1.149), NVME (R101.2)
FLIP6_P: JETSON (D17.5 D17.6 J1.151), NVME (R103.2)
FLIP7_N: JETSON (D16.1 D16.10 J1.155), NVME (R104.2)
FLIP7_P: JETSON (D16.2 D16.9 J1.157), NVME (R105.2)
GBE_LED_ACT: JETSON (J1.194), ETHERNET (J5.L4)
GBE_LED_LINK: JETSON (J1.188), ETHERNET (J5.L2)
GBE_MDI0_N: JETSON (D5.1 D5.10 J1.184), ETHERNET (J5.2)
GBE_MDI0_P: JETSON (D5.2 D5.9 J1.186), ETHERNET (J5.1)
GBE_MDI1_N: JETSON (D5.4 D5.7 J1.190), ETHERNET (J5.4)
GBE_MDI1_P: JETSON (D5.5 D5.6 J1.192), ETHERNET (J5.3)
GBE_MDI2_N: JETSON (D12.1 D12.10 J1.196), ETHERNET (J5.8)
GBE_MDI2_P: JETSON (D12.2 D12.9 J1.198), ETHERNET (J5.7)
GBE_MDI3_N: JETSON (D12.4 D12.7 J1.202), ETHERNET (J5.10)
GBE_MDI3_P: JETSON (D12.5 D12.6 J1.204), ETHERNET (J5.9)
HDMI_nSLEEP: JETSON (J1.178), HDMI (R281.2 U10.5), PWR_MGMT_CAN_IF (R354.1), STM32H730_PINOUT (R257.2)
I2C0_SCL: VISION_BETA_EBB (TP19.1), JETSON (D2.4 D2.7 J1.185)
I2C0_SDA: VISION_BETA_EBB (TP20.1), JETSON (D2.5 D2.6 J1.187)
I2C1_SCL: JETSON (J1.189), NVME (R289.2)
I2C1_SDA: JETSON (J1.191), NVME (R288.2)
INT_VCC_I_SENSE: PWR_MGMT (C188.2 U18.11), ADC (U16.7)
nFORCE_RECOVERY: JETSON (J1.214 J17.1 R355.1), STM32H730_PINOUT (R256.2)
nPWDN: VISION_BETA_EBB (R295.2), GMSL_SERIALIZER (R165.2), STM32H730_PINOUT (R362.2)
nSHUTDOWN_REQ: JETSON (J1.233), PWR_MGMT_CAN_IF (R331.1), STM32H730_PINOUT (R253.2)
nSYS_RESET: JETSON (J1.239), PWR_MGMT_CAN_IF (R351.1), STM32H730_PINOUT (R254.2)
PCIE0_CLK_N: JETSON (D1.1 D1.10 J1.160), NVME (C137.2)
PCIE0_CLK_P: JETSON (D1.2 D1.9 J1.162), NVME (C138.2)
PCIE0_nCLKREQ: JETSON (J1.180), NVME (R107.2)
PCIE0_nRST: JETSON (D2.2 D2.9 J1.181), NVME (R106.2)
PCIE_32K_CLK: JETSON (R174.1 U11.4), NVME (R292.2)
PCIE_WAKE: JETSON (D2.1 D2.10 J1.179), NVME (R108.2)
POWER_EN: JETSON (J1.237), PWR_MGMT_CAN_IF (R304.2 R317.1), STM32H730_PINOUT (R252.2)
PRE_CK_N: GMSL_DESERIALIZER_0 (C28_GMSL_DESERIALIZER_0.1), GMSL_SERIALIZER (C233.1)
PRE_CK_P: GMSL_DESERIALIZER_0 (C25_GMSL_DESERIALIZER_0.1), GMSL_SERIALIZER (C231.1)
PRE_D0_N: GMSL_DESERIALIZER_0 (C16_GMSL_DESERIALIZER_0.1), GMSL_SERIALIZER (C223.1)
PRE_D0_P: GMSL_DESERIALIZER_0 (C15_GMSL_DESERIALIZER_0.1), GMSL_SERIALIZER (C222.1)
PRE_D1_N: GMSL_DESERIALIZER_0 (C18_GMSL_DESERIALIZER_0.1), GMSL_SERIALIZER (C225.1)
PRE_D1_P: GMSL_DESERIALIZER_0 (C17_GMSL_DESERIALIZER_0.1), GMSL_SERIALIZER (C224.1)
PRE_D2_N: GMSL_DESERIALIZER_0 (C20_GMSL_DESERIALIZER_0.1), GMSL_SERIALIZER (C227.1)
PRE_D2_P: GMSL_DESERIALIZER_0 (C19_GMSL_DESERIALIZER_0.1), GMSL_SERIALIZER (C226.1)
PRE_D3_N: GMSL_DESERIALIZER_0 (C24_GMSL_DESERIALIZER_0.1), GMSL_SERIALIZER (C230.1)
PRE_D3_P: GMSL_DESERIALIZER_0 (C23_GMSL_DESERIALIZER_0.1), GMSL_SERIALIZER (C229.1)
PRE_VCC_SENSE: PWR_MGMT (R157.2 R163.2), ADC (U17.4)
PWR_IN: VISION_BETA_EBB (J9.1 J9.2 J9.5 J9.6), PWR_MGMT (F1.1)
SLEEP/nWAKE: JETSON (J1.240 R316.2), PWR_MGMT_CAN_IF (R312.2), STM32H730_PINOUT (R255.2)
TP_CSI1_CK_N: VISION_BETA_EBB (TP74.1), GMSL_DESERIALIZER_1 (C28_GMSL_DESERIALIZER_1.1)
TP_CSI1_CK_P: VISION_BETA_EBB (TP73.1), GMSL_DESERIALIZER_1 (C25_GMSL_DESERIALIZER_1.1)
TP_CSI1_D0_N: VISION_BETA_EBB (TP66.1), GMSL_DESERIALIZER_1 (C16_GMSL_DESERIALIZER_1.1)
TP_CSI1_D0_P: VISION_BETA_EBB (TP65.1), GMSL_DESERIALIZER_1 (C15_GMSL_DESERIALIZER_1.1)
TP_CSI1_D1_N: VISION_BETA_EBB (TP68.1), GMSL_DESERIALIZER_1 (C18_GMSL_DESERIALIZER_1.1)
TP_CSI1_D1_P: VISION_BETA_EBB (TP67.1), GMSL_DESERIALIZER_1 (C17_GMSL_DESERIALIZER_1.1)
TP_CSI1_D2_N: VISION_BETA_EBB (TP70.1), GMSL_DESERIALIZER_1 (C20_GMSL_DESERIALIZER_1.1)
TP_CSI1_D2_P: VISION_BETA_EBB (TP69.1), GMSL_DESERIALIZER_1 (C19_GMSL_DESERIALIZER_1.1)
TP_CSI1_D3_N: VISION_BETA_EBB (TP72.1), GMSL_DESERIALIZER_1 (C24_GMSL_DESERIALIZER_1.1)
TP_CSI1_D3_P: VISION_BETA_EBB (TP71.1), GMSL_DESERIALIZER_1 (C23_GMSL_DESERIALIZER_1.1)
USB0_D_N: JETSON (D9.1 D9.10 J1.109), RECOVERY_USBC (J10.2)
USB0_D_P: JETSON (D9.2 D9.9 J1.111), RECOVERY_USBC (J10.3)
USB1_D_N: JETSON (D9.4 D9.7 J1.115), USB (R32.1)
USB1_D_P: JETSON (D9.5 D9.6 J1.117), USB (R33.1)
USBSS0_RX_N: JETSON (D16.4 D16.7 J1.161), USB (R184.1)
USBSS0_RX_P: JETSON (D16.5 D16.6 J1.163), USB (R185.1)
USBSS0_TX_N: JETSON (D1.4 D1.7 J1.166), USB (C59.2)
USBSS0_TX_P: JETSON (D1.5 D1.6 J1.168), USB (C60.2)
VBUS_DETECT: JETSON (J1.87), RECOVERY_USBC (R1.2)
VCC_SENSE: PWR_MGMT (R158.2 R164.2), ADC (U17.5)